# EAGLE design ExpressCarduino-Basic (EAGLE 9.1.2)
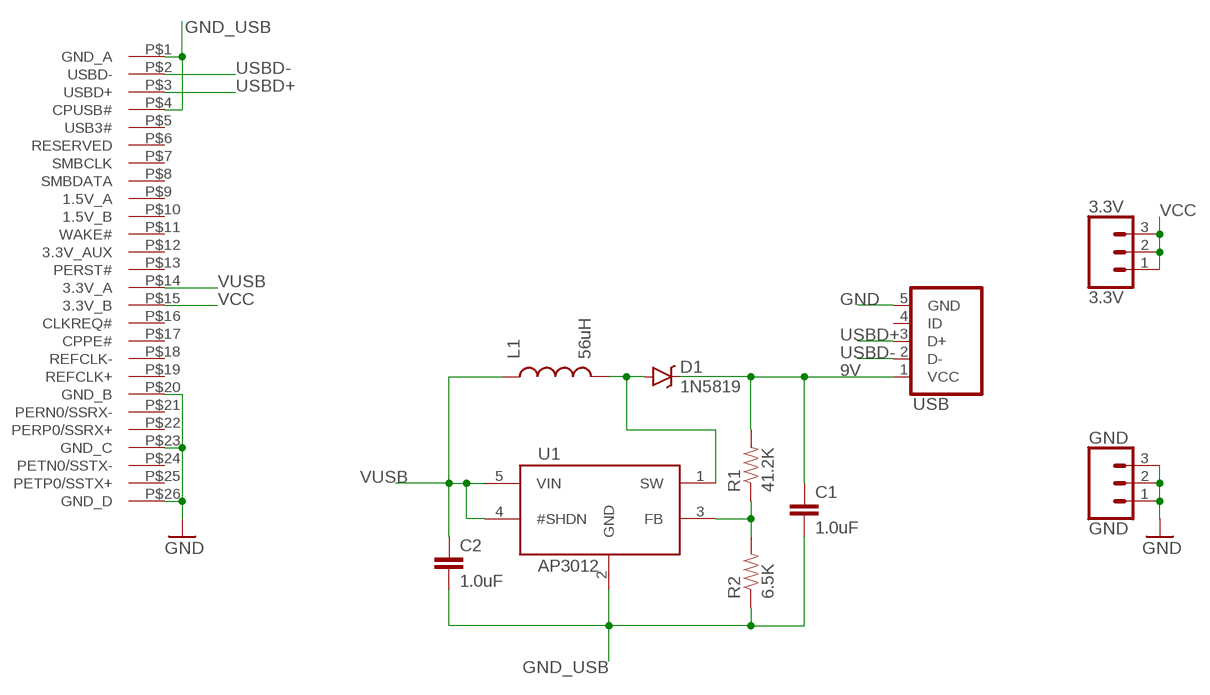
[diagram p0: schematic, sheet 1]

## Parts
3.3V  3.3V  CONN_03  [1X03]
C1  1.0uF  1.0UF-16V-10%(0603)  [0603-CAP]
C2  1.0uF  1.0UF-16V-10%(0603)  [0603-CAP]
D1  1N5819  DIODE-SCHOTTKY  [SOD-123]
GND  GND  CONN_03  [1X03]
L1  56uH  INDUCTORSDR0403-560KL  [SDR0403]
R1  41.2K  0.22OHM-1/4W-1%(0805)  [0805]
R2  6.5K  0.22OHM-1/4W-1%(0805)  [0805]
U1  AP3012  [SOT23-5]
U$1  EXPRESSCARD34  [EXPRESSCARD34]
USB  USB_MICROB_PLUG"  [MICRO-B-RA-SMT]

## Nets
9V: C1.1 D1.C R1.2 USB.1(VCC)
GND: GND.1 GND.2 GND.3 U$1.P$20(GND_B) U$1.P$23(GND_C) U$1.P$26(GND_D) USB.5(GND)
GND_USB: C1.2 C2.2 R2.1 U1.2(GND) U$1.P$1(GND_A) U$1.P$4(CPUSB#)
N$1: R1.1 R2.2 U1.3(FB)
N$3: D1.A L1.P$2 U1.1(SW)
USBD+: U$1.P$3(USBD+) USB.3(D+)
USBD-: U$1.P$2(USBD-) USB.2(D-)
VCC: 3.3V.1 3.3V.2 3.3V.3 U$1.P$15(3.3V_B)
VUSB: C2.1 L1.P$1 U1.4(#SHDN) U1.5(VIN) U$1.P$14(3.3V_A)
Unconnected: U$1.P$5(USB3#) U$1.P$6(RESERVED) U$1.P$7(SMBCLK) U$1.P$8(SMBDATA) U$1.P$9(1.5V_A) U$1.P$10(1.5V_B) U$1.P$11(WAKE#) U$1.P$12(3.3V_AUX) U$1.P$13(PERST#) U$1.P$16(CLKREQ#) U$1.P$17(CPPE#) U$1.P$18(REFCLK-) U$1.P$19(REFCLK+) U$1.P$21(PERN0/SSRX-) U$1.P$22(PERP0/SSRX+) U$1.P$24(PETN0/SSTX-) U$1.P$25(PETP0/SSTX+) USB.4(ID)

## Library data of the parts
3.3V GND = SparkFun-Connectors:CONN_03: Multi connection point. Often used as Generic Header-pin footprint for 0.1 inch spaced/style header connections On any of the 0.1 inch spaced packages, you can populate with these: Break Away Headers - Straight <https://www.sparkfun.com/products/116> (PRT-00116) Break Away Male Headers - Right Angle <https://www.sparkfun.com/products/553> (PRT-00553) Female Headers <https://www.sparkfun.com/products/115> (PRT-00115) Break Away Headers - Machine Pin <https://www.sparkfun.com/products/117> (PRT-00117) Break Away Female Headers - Swiss Machine Pin <https://www.sparkfun.com/products/743> (PRT-00743) Stackable Header - 3 Pin (Female, 0.1") <https://www.sparkfun.com/products/13875> (PRT-13875) For SCREWTERMINALS and SPRING TERMINALS visit here: Screw Terimnals on SparkFun.com <https://www.sparkfun.com/search/results?term=Screw+Terminals> (5mm/3.5mm/2.54mm spacing) This device is also useful as a general connection point to wire up your design to another part of your project. Our various solder wires solder well into these plated through hole pads. Hook-Up Wire - Assortment (Stranded, 22 AWG) <https://www.sparkfun.com/products/11375> (PRT-11375) Hook-Up Wire - Assortment (Solid Core, 22 AWG) <https://www.sparkfun.com/products/11367> (PRT-11367) View the entire wire category on our website here <https://www.sparkfun.com/categories/141> Special notes: Molex polarized connector foot print use with SKU : PRT-08232 with associated crimp pins and housings.
C1 C2 = SparkFun-Capacitors:1.0UF-16V-10%(0603): CAP-00868; PROD_ID: CAP-00868
D1 = HokieGeek:DIODE-SCHOTTKY: Schottky diodes in SFE's production catalog BAT20J 1A 23V 0.62Vf RB751 120mA 40V 0.37Vf PMEG4005EJ 0.5A 40V 0.42Vf MBRA140 1A 40V 0.5Vf B340A 3A 40V SMA
L1 = SparkFun-Passives:INDUCTOR: Inductors Basic Inductor/Choke - 0603 and 1206. Footprints are not proven and vary greatly between part numbers. INDUCTOR POWER 3.3UH 4.0A SMD 0.197" L x 0.197" W x 0.177" H (5.00mm x 5.00mm x 4.50mm); DIST: DIGIKEY; DIST_ID: SDR0403-560KLCT-ND
R1 R2 = SparkFun-Resistors:0.22OHM-1/4W-1%(0805): RES-09883; PROD_ID: RES-09883; VALUE: 0.22
U1 = HokieGeek:AP3012: Single-gate AND logic; PROD_ID: 10841; VALUE: 74LVC1G08
U$1 = HokieGeek:EXPRESSCARD34: Pads for an SMD mounted ExpressCard
USB = HokieGeek:USB_MICROB_PLUG: USB Micro-B connectors Some male, some female. Watch your step!

## Board
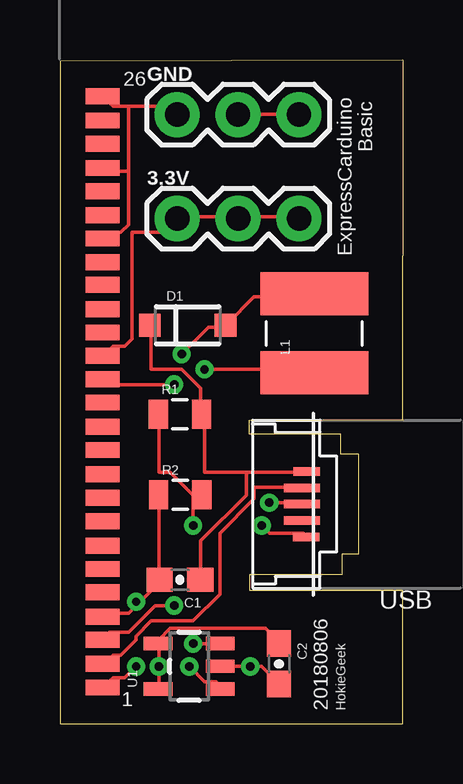
[diagram p1: board, top side]
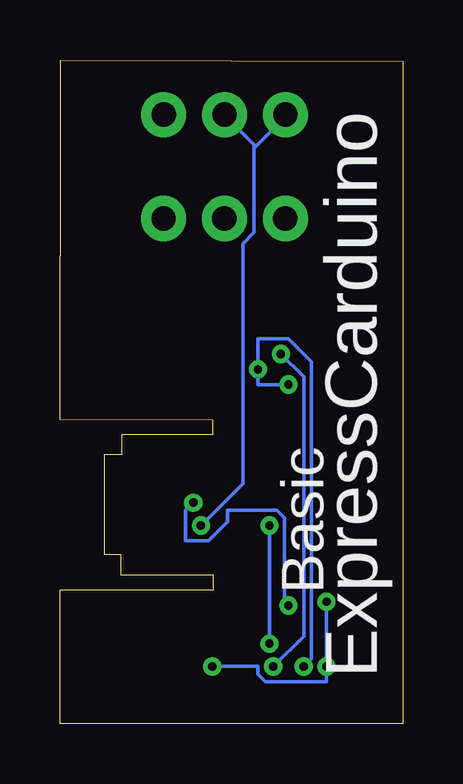
[diagram p2: board, bottom side, seen from below]

Size 14.29 x 27.65 mm. Coordinates in mm from the lower left corner, seen from the top.
Outline: 14.29,27.65 0,27.6 0,0 14.29,0 14.29,5.57 7.91,5.57 7.91,6.2 11.75,6.2 11.75,7.07 12.45,7.07 12.45,11.22 11.71,11.22 11.71,12.06 9.74,12.06 7.91,12.06 7.91,12.64 14.29,12.65 14.29,19.39 14.29,19.49 14.29,27.65
Copper layers (1*16): Top 0.035mm / dielectric 1.5mm / Bottom 0.035mm
Design rules "default": minimum track width 6mil, minimum drill 0.35mm, track to track 6mil, track to pad 6mil, pad to pad 6mil, via to via 6mil, smd to smd 6mil, copper to edge 40mil, drill to drill 6mil, minimum pad ring 10mil, minimum via ring 8mil, stop-mask expansion 4mil, vias tented up to drill 0mil, thermal gap 10mil
tRestrict: area 20.3,0.1 to 64.3,18.1

### Footprints (pad centres in the part's own frame; a part is rotated, then mirrored left to right if it is on the bottom)
1X03 = drill 1.016 pad 1.88: 1 0,0; 2 2.54,0; 3 5.08,0
0603-CAP = smd 1.1 x 1: 1 -0.85,0; 2 0.85,0
SOD-123 = smd 0.9 x 0.95: A 1.575,0; C -1.575,0
SDR0403 = smd 1.8 x 4.5: P$1 -1.65,0; P$2 1.65,0
0805 = smd 0.8 x 1.2: 1 -0.9,0; 2 0.9,0
SOT23-5 = smd 0.55 x 1.2: 1 -0.95,-1.3; 2 0,-1.3; 3 0.95,-1.3; 4 0.95,1.3; 5 -0.95,1.3
EXPRESSCARD34 = smd 1.422 x 0.66: P$1 -0.066,-12.896; P$2 -0.066,-11.9; P$3 -0.066,-10.903; P$4 -0.066,-9.94; P$5 -0.066,-8.929; P$6 -0.066,-7.955; P$7 -0.066,-6.982; P$8 -0.066,-5.961; P$9 -0.066,-4.987; P$10 -0.066,-4.015; P$11 -0.066,-3.001; P$12 -0.066,-2.035; P$13 -0.066,-1.02; P$14 -0.066,-0.047; P$15 -0.066,0.926; P$16 -0.066,1.899; P$17 -0.066,2.872; P$18 -0.066,3.886; P$19 -0.066,4.818; P$20 -0.066,5.816; P$21 -0.066,6.789; P$22 -0.066,7.779; P$23 -0.066,8.752; P$24 -0.066,9.766; P$25 -0.066,10.731; P$26 -0.066,11.746
MICRO-B-RA-SMT = smd 0.35 x 1.1: 1 1.363,1.542; 5 -1.363,1.574 | smd 0.35 x 1.5: 2 0.682,1.742; 3 0,1.742; 4 -0.682,1.742

### Placement (x,y rotation side)
3.3V  4.89,21.05 0 top
C1  5.01,6 180 top
C2  9.14,2.49 270 top
D1  5.33,16.6 0 top
GND  4.89,25.38 0 top
L1  10.61,16.26 90 top
R1  5,12.89 0 top
R2  5.02,9.54 0 top
U1  5.39,2.39 90 top
U$1  1.84,14.4 0 top
USB  11.84,9.14 90 top

### Tracks (layer width: path | path; a pad name or v marks a point on that pad's centre or on a via)
9V
  Top 0.152: D1.C 3.81,16.51 3.81,14.76 5.08,14.76 5.87,13.97 5.87,13.02 R1.2 6.03,12.86 6.03,10.48 7.78,10.48 | 7.78,10.48 7.78,9.53 5.87,7.62 5.87,6.03 C1.1 | 7.78,10.48 10.16,10.48 USB.1
GND  (via drill 0.35)
  Top 0.152: 2.86,23.02 2.86,20.8 2.54,20.48 2.06,20.48 1.91,20.32 U$1.P$20 | 2.86,23.02 1.91,23.02 U$1.P$23 | 2.86,25.72 4.45,25.72 4.76,25.4 GND.1 | 2.86,25.72 2.22,25.72 1.91,26.04 U$1.P$26 | 2.86,25.72 2.86,23.02 | v8.41,8.26 8.73,7.94 10.16,7.94 USB.5 | GND.3 9.84,25.4 7.46,25.4 GND.2
  Bottom 0.152: v8.41,8.26 6.67,10 6.67,20 6.19,20.48 6.19,23.97 | 6.19,23.97 6.19,24.13 7.3,25.24 GND.2 | 6.19,23.97 4.92,25.24 GND.1
GND_USB  (via drill 0.35)
  Top 0.152: C2.2 9.05,1.75 8.41,2.38 v7.94,2.38 6.83,2.38 U1.2 | 3.33,5.08 2.86,4.6 1.91,4.6 U$1.P$4 | 3.33,5.08 4.13,5.87 C1.2 4.13,6.03 4.13,9.53 R2.1 | v3.17,2.38 2.7,1.91 2.22,1.91 1.91,1.59 U$1.P$1 | 3.33,5.08 v3.17,5.08
  Bottom 0.152: v3.17,5.08 v3.17,2.38 3.17,1.75 5.71,1.75 6.03,2.06 6.03,2.38 v7.94,2.38
N$1  (via drill 0.35)
  Top 0.152: v5.56,3.33 6.67,3.33 U1.3 | 5.56,9.53 v5.56,8.26 | 5.56,9.53 5.87,9.53 R2.2 5.56,9.53 | 5.56,9.53 4.6,10.48 4.13,10.48 4.13,12.86 R1.1
  Bottom 0.152: v5.56,8.26 v5.56,3.33
N$3  (via drill 0.35)
  Top 0.152: L1.P$2 10.48,17.78 8.1,17.78 6.99,16.67 D1.A 6.83,16.51 6.19,16.51 v5.08,15.4 | v5.4,2.38 6.03,1.75 6.51,1.75 6.67,1.59 U1.1
  Bottom 0.152: v5.4,2.38 4.13,3.65 4.13,14.45 v5.08,15.4
USBD+  (via drill 0.35)
  Top 0.152: v4.76,4.92 3.97,4.92 2.86,3.81 2.06,3.81 1.91,3.65 U$1.P$3 | v8.73,9.21 10,9.21 USB.3
  Bottom 0.152: v4.76,4.92 4.92,5.08 4.92,8.57 5.24,8.89 7.3,8.89 7.3,8.41 8.1,7.62 9.05,7.62 9.05,8.89 v8.73,9.21
USBD-
  Top 0.152: U$1.P$2 1.91,2.54 2.22,2.86 2.54,2.86 3.17,3.49 3.17,3.65 3.81,4.29 5.56,4.29 6.67,5.4 6.67,7.94 8.1,9.37 8.1,9.84 10,9.84 USB.2
VCC
  Top 0.152: 3.3V.3 9.84,21.11 7.46,21.11 3.3V.2 7.3,21.11 4.92,21.11 3.3V.1 4.76,20.95 4.29,20.48 3.02,20.48 3.02,16.03 2.7,15.72 2.22,15.72 1.91,15.4 U$1.P$15
VUSB  (via drill 0.35)
  Top 0.152: C2.1 9.05,3.49 8.57,3.97 4.6,3.97 4.13,3.49 U1.4 4.13,3.33 v4.13,2.38 4.13,1.59 U1.5 | v4.76,14.13 2.06,14.13 1.91,14.29 U$1.P$14 | v6.03,14.76 10.48,14.76 L1.P$1
  Bottom 0.152: v4.76,14.13 6.03,14.13 v6.03,14.76 6.03,16.03 4.76,16.03 3.81,15.08 3.81,2.7 v4.13,2.38

### Text on the board
tPlace: Basic | ExpressCarduino | 20180806 | HokieGeek
bPlace: Basic | ExpressCarduino
tDocu: Adafruit Metro Mini 328